# Altium schematic sheet rgb-leds.SchDoc: RGB LEDs
size A4; Organization: heig-vd; Address1: heig-vd; Address2: Route de Cheseaux 1; Address3: 1401 Yverdon-les-Bains; Address4: Suisse; DocumentNumber: 11; Revision: 1.1; SheetNumber: 11; SheetTotal: 12
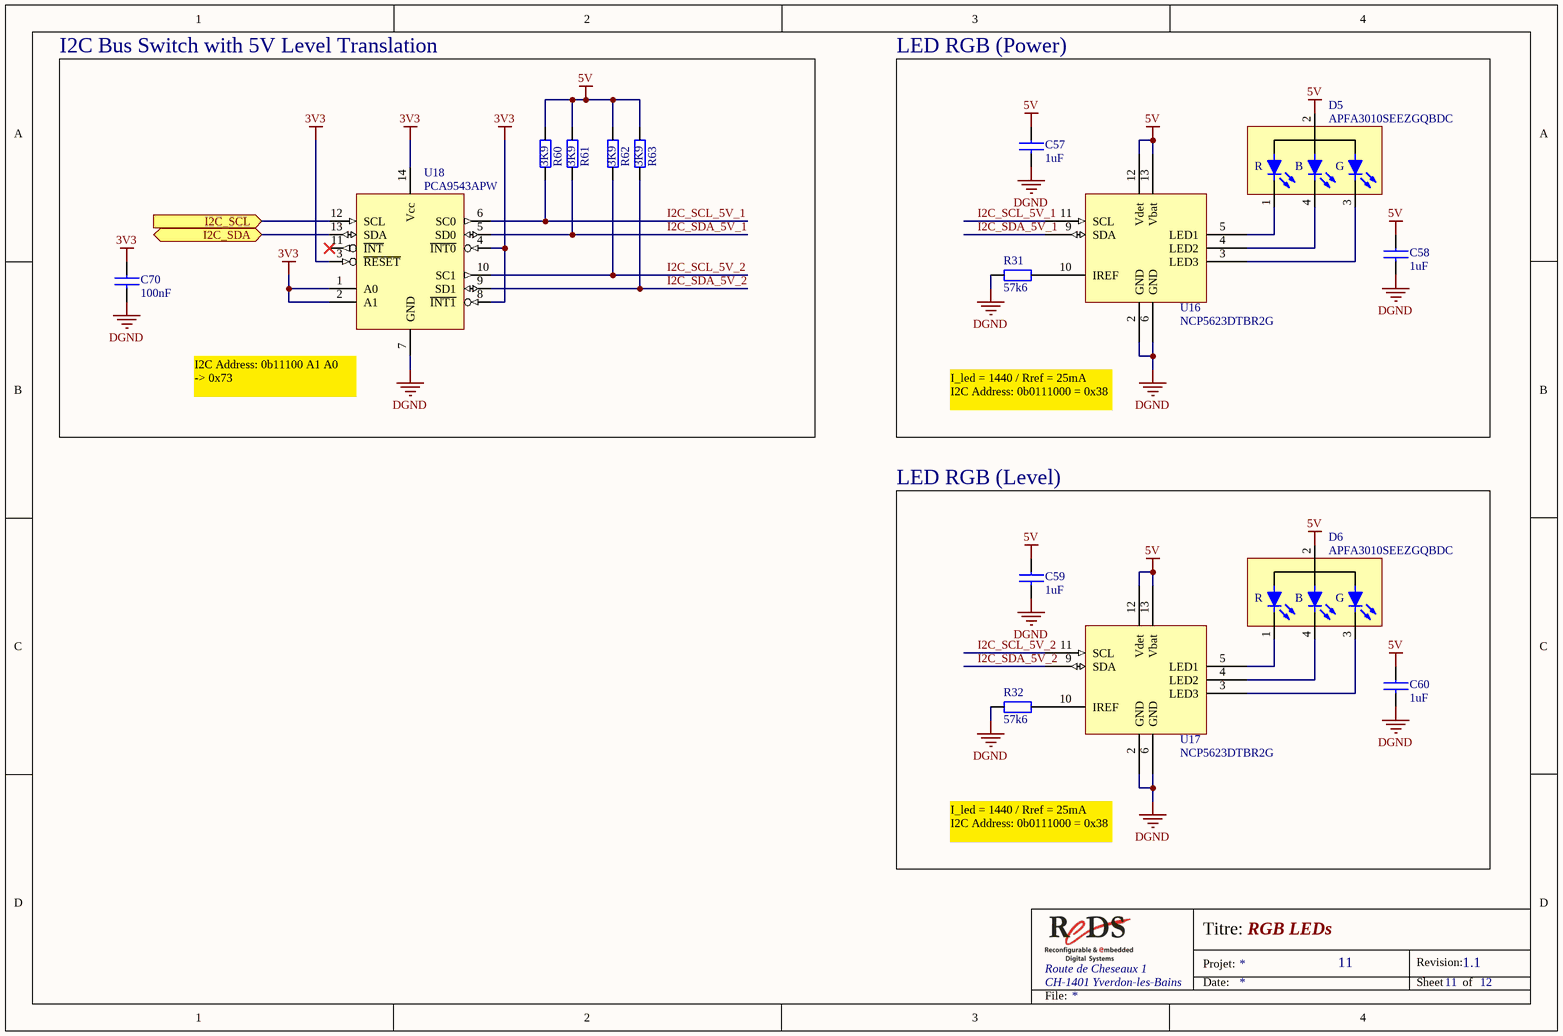
[diagram p0: rgb-leds.SchDoc]

## Parts
C57  1uF  [SM/C_0603]
C58  1uF  [SM/C_0603]
C59  1uF  [SM/C_0603]
C60  1uF  [SM/C_0603]
C70  100nF  [SM/C_0603]
D5  APFA3010SEEZGQBDC  [APFA3010]
D6  APFA3010SEEZGQBDC  [APFA3010]
R31  57k6  [SM/R_0603]
R32  57k6  [SM/R_0603]
R60  3K9  [SM/R_0603]
R61  3K9  [SM/R_0603]
R62  3K9  [SM/R_0603]
R63  3K9  [SM/R_0603]
U16  NCP5623DTBR2G  [TSSOP-14]
U17  NCP5623DTBR2G  [TSSOP-14]
U18  PCA9543APW  [TSSOP-14]

## Blocks framed on the sheet
I2C Bus Switch with 5V Level Translation: C70 R60-R63 U18
LED RGB (Power): C57 C58 D5 R31 U16
LED RGB (Level): C59 C60 D6 R32 U17

## Ports
I2C_SCL (in), I2C_SDA (bidir)

## Nets
3V3: C70.1 U18.1(A0) U18.2(A1) U18.3(~{RESET}) U18.4(~{INT0}) U18.8(~{INT1}) U18.14(Vcc)
5V: C57.1 C58.1 C59.1 C60.1 D5.2(A) D6.2(A) R60.1 R61.1 R62.1 R63.1 U16.12(Vdet) U16.13(Vbat) U17.12(Vdet) U17.13(Vbat)
DGND: C57.2 C58.2 C59.2 C60.2 C70.2 R31.1 R32.1 U16.2(GND) U16.6(GND) U17.2(GND) U17.6(GND) U18.7(GND)
I2C_SCL: U18.12(SCL) ; port I2C_SCL
I2C_SCL_5V_1: R60.2 U16.11(SCL) U18.6(SC0)
I2C_SCL_5V_2: R62.2 U17.11(SCL) U18.10(SC1)
I2C_SDA: U18.13(SDA) ; port I2C_SDA
I2C_SDA_5V_1: R61.2 U16.9(SDA) U18.5(SD0)
I2C_SDA_5V_2: R63.2 U17.9(SDA) U18.9(SD1)
NetD5_1: D5.1(C) U16.5(LED1)
NetD5_3: D5.3(C) U16.3(LED3)
NetD5_4: D5.4(C) U16.4(LED2)
NetD6_1: D6.1(C) U17.5(LED1)
NetD6_3: D6.3(C) U17.3(LED3)
NetD6_4: D6.4(C) U17.4(LED2)
NetR31_2: R31.2 U16.10(IREF)
NetR32_2: R32.2 U17.10(IREF)

Not connected (* = marked no-connect by the designer): U16 1(IC) 7(NC) 8(NC) 14(IC); U17 1(IC) 7(NC) 8(NC) 14(IC); U18 11(~{INT})*

## Notes on the sheet
- (near U18) I2C Address: 0b11100 A1 A0
  -> 0x73
- I_led = 1440 / Rref = 25mA
  I2C Address: 0b0111000 = 0x38
- Route de Cheseaux 1
- CH-1401 Yverdon-les-Bains
- Titre:
- Date:
- Projet:
- Revision:
- Sheet
- of
- File:
- (in symbol Led RGB RA) R; B; G

## Library data of the parts
C57-C60 = 5: Ceramic multi-layer; Manufacturer: MURATA; Manufacturer P/N: GRM188R61A105KA61D; ID: 5; Voltage: 10V; Tolerance: ±10%; Value: 1uF; Component Type: Capacitor, non-polarized; Supplier 1: Digi-Key; Supplier Part Number 1: 490-1543-2-ND; Supplier 2: Mouser; Supplier Part Number 2: 81-GRM39R105K10; RoHS Compliant: True; ComponentLink1Description: Datasheet; ComponentLink1URL: http://psearch.murata.com/capacitor/product/GRM188R61A105KA61%23.pdf; ComponentLink2Description: Supplier; ComponentLink2URL: http://www.digikey.fr/product-detail/fr/GRM188R61A105KA61D/490-1543-1-ND/587782
C70 = 182: Ceramic multi-layer; Manufacturer: AVX; Manufacturer P/N: 0603YC104KAZ2A; ID: 182; Voltage: 16V; Tolerance: ±10%; Value: 100nF; Component Type: Capacitor, non-polarized; Supplier 1: Farnell; Supplier Part Number 1: 7569556; RoHS Compliant: True
D5 D6 = Led RGB RA: 3.0x1.0mm RIGHT ANGLE SMD CHIP LED  LAMP; Supplier 1: Mouser; Supplier 2: Digi-Key; Supplier Part Number 1: 604-APFA3010SEEZGQBD; Supplier Part Number 2: 754-1649-6-ND
R31 R32 = Res_57k6: Résistance 0603 100mW 1% 57k6; Manufacturer: Panasonic; Manufacturer P/N: ERJ-3EKF5762V; Voltage: 75V; Value: 57k6; Component Type: Résistance; Power: 100mW; Tolerance: 1%; RoHS Compliant: True; Supplier 1: Allied; Supplier 2: Mouser; Supplier 3: Digi-Key; Supplier Part Number 1: 70265864; Supplier Part Number 2: 667-ERJ-3EKF5762V; Supplier Part Number 3: P57.6KHDKR-ND
R60-R63 = 123: Résistance 0603 63mW 1% 3K9; Manufacturer: Multicomp; Manufacturer P/N: MC 0.036mW 0603 1% 3K9; ID: 123; Voltage: 50V; Value: 3K9; Component Type: Résistance; Power: 63mW; Tolerance: 1%; Supplier 1: Farnell; Supplier Part Number 1: 9331140; RoHS Compliant: False
U16 U17 = NCP5623DTBR2G: Triple Output I2C Controlled RGB LED Driver; Supplier 1: Mouser; Supplier 2: Arrow; Supplier 3: Digi-Key; Supplier Part Number 1: 863-NCP5623DTBR2G; Supplier Part Number 2: 9JGsNSaWsajKjxt30OCY0Xm9Z4kl474dJyr_l9lYFAQ; Supplier Part Number 3: NCP5623DTBR2GOSCT-ND
U18 = PCA9543APW: 2-Channel I2C Bus Switch With Interrupt Logic and Reset; Supplier 1: Arrow; Supplier 2: Digi-Key; Supplier Part Number 1: CXrcX0Ksgu2EXoGfPTOdms8Pzusfh2ExCB2AT9PF3AQ; Supplier Part Number 2: 296-22770-1-ND